# EAGLE design temp_board1 - itr2_V2 (EAGLE 9.6.2)
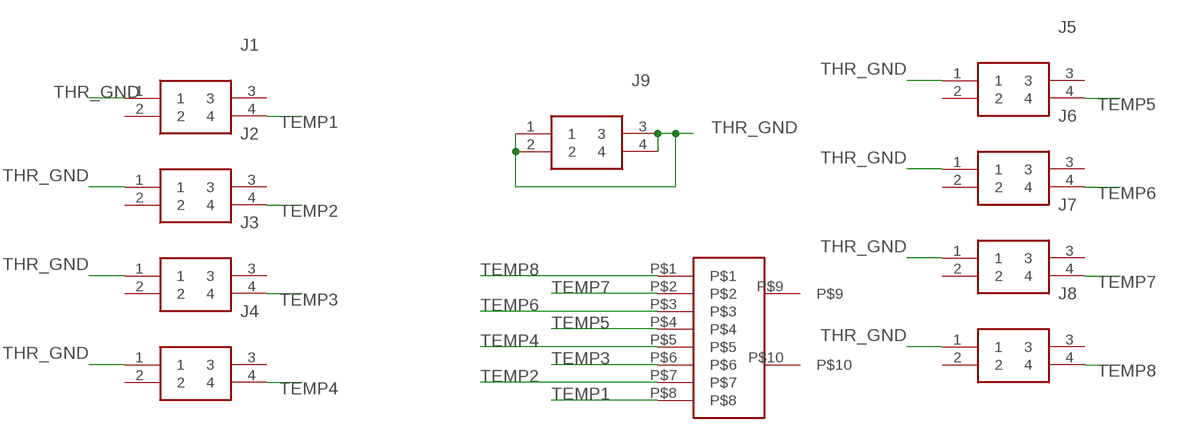
[diagram p0: schematic, sheet 1]

## Parts
J1  43045-0415  [43045-04YY_15,16,17]
J2  43045-0415  [43045-04YY_15,16,17]
J3  43045-0415  [43045-04YY_15,16,17]
J4  43045-0415  [43045-04YY_15,16,17]
J5  43045-0415  [43045-04YY_15,16,17]
J6  43045-0415  [43045-04YY_15,16,17]
J7  43045-0415  [43045-04YY_15,16,17]
J8  43045-0415  [43045-04YY_15,16,17]
J9  43045-0415  [43045-04YY_15,16,17]
U$35  VERTICALBMS8  [VERTICALBMS8]

## Nets
TEMP1: J1.4 U$35.P$8
TEMP2: J2.4 U$35.P$7
TEMP3: J3.4 U$35.P$6
TEMP4: J4.4 U$35.P$5
TEMP5: J5.4 U$35.P$4
TEMP6: J6.4 U$35.P$3
TEMP7: J7.4 U$35.P$2
TEMP8: J8.4 U$35.P$1
THR_GND: J1.1 J2.1 J3.1 J4.1 J5.1 J6.1 J7.1 J8.1 J9.1 J9.2 J9.3 J9.4
Unconnected: J1.2 J1.3 J2.2 J2.3 J3.2 J3.3 J4.2 J4.3 J5.2 J5.3 J6.2 J6.3 J7.2 J7.3 J8.2 J8.3 U$35.P$9 U$35.P$10

## Library data of the parts
J1-J9 = 43045-0415:43045-0415: Micro-Fit 3.0 Vertical Header, 3.00mm Pitch, Dual Row, 4 Circuits, with PCB Press-fit Metal Retention Clip, Glow-Wire Capable Source: Datasheet <https://www.molex.com/pdm_docs/sd/430450416_sd.pdf>; DESCRIPTION: Micro-Fit 3.0 Vertical Header, 3.00mm Pitch, Dual Row, 4 Circuits, with PCB Press-fit Metal Retention Clip, Glow-Wire Capable; HEIGHT: 9.91mm; MANUFACTURER_NAME: Molex; MANUFACTURER_PART_NUMBER: 43045-0415; MOUSER_PART_NUMBER: 538-43045-0415; MOUSER_PRICE-STOCK: https://www.mouser.co.uk/ProductDetail/Molex/43045-0415?qs=jbJnFeK%2FK6yEAHtN9jCMQg%3D%3D
U$35 = IIT_BOMBAY_Racing2:VERTICALBMS8

## Board
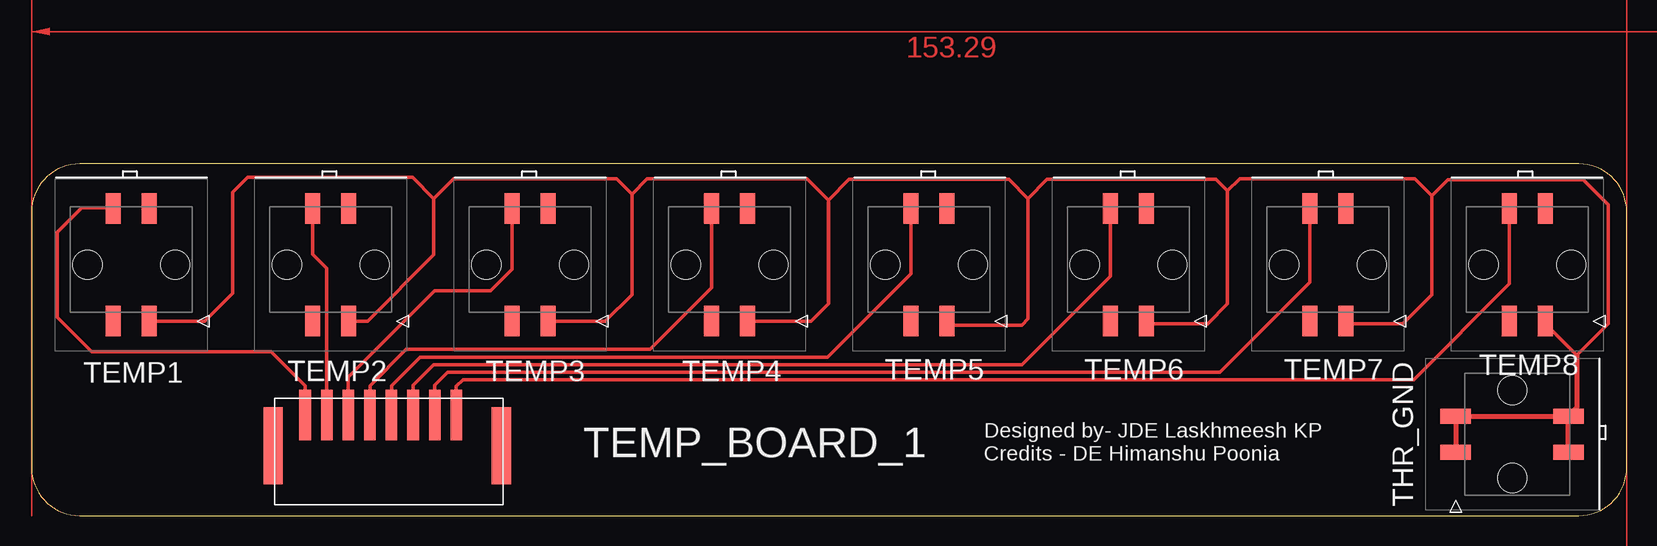
[diagram p1: board, top side]
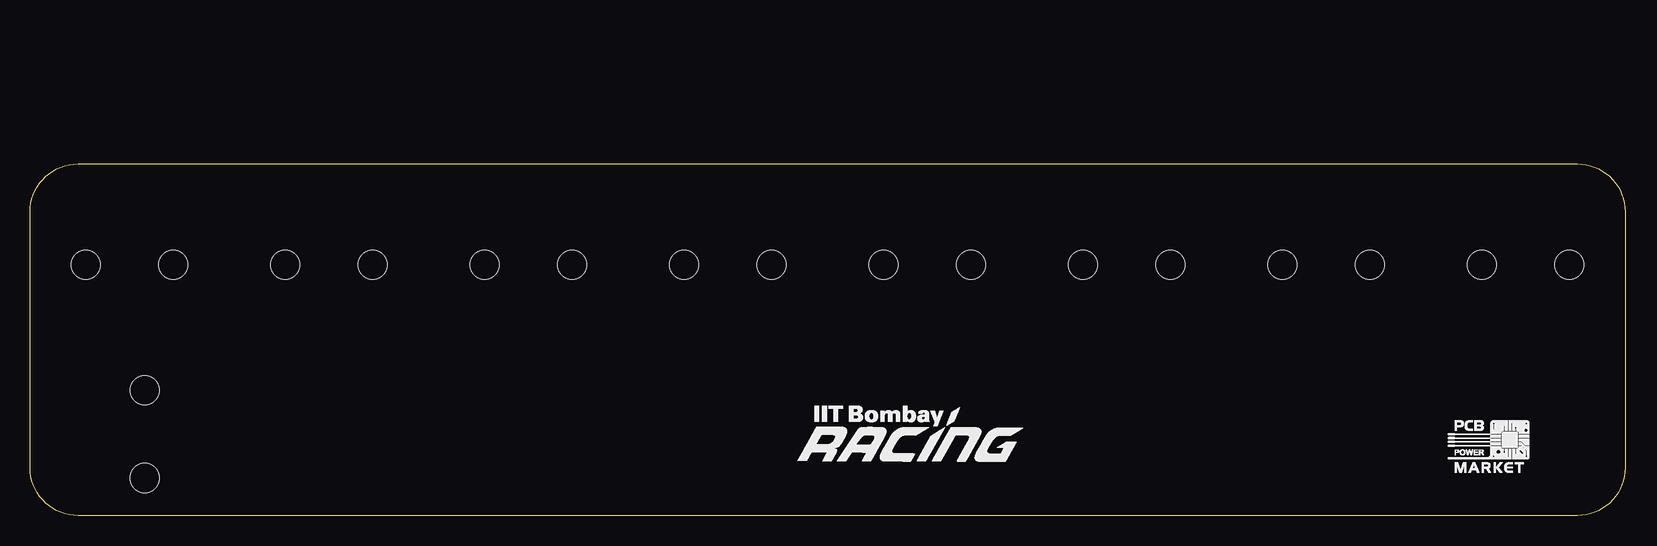
[diagram p2: board, bottom side, seen from below]

Size 132.97 x 29.31 mm. Coordinates in mm from the lower left corner, seen from the top.
Outline: 0,25.31 0,4 arc90 4,0 128.97,0 arc90 132.97,4 132.97,25.31 arc90 128.97,29.31 4,29.31 arc90 0,25.31
Copper layers (1*16): Top 0.035mm / dielectric 1.5mm / Bottom 0.035mm
Design rules "PCB_Power": minimum track width 5mil, minimum drill 10mil, track to track 5mil, track to pad 5mil, pad to pad 5mil, via to via 5mil, smd to smd 5mil, copper to edge 10mil, drill to drill 6mil, minimum pad ring 5mil, minimum via ring 5mil, stop-mask expansion 3mil, vias tented up to drill 0mil, thermal gap 10mil

### Footprints (pad centres in the part's own frame; a part is rotated, then mirrored left to right if it is on the bottom)
43045-04YY_15,16,17 = smd 1.27 x 2.54: 1 1.5,-4.7; 2 -1.5,-4.7; 3 1.5,4.7; 4 -1.5,4.7 | hole 2.41: 3.65,0; -3.65,0
VERTICALBMS8 = smd 0.97 x 4.2: P$1 -6.246,23; P$2 -4.446,23; P$3 -2.646,23; P$4 -0.846,23; P$5 0.954,23; P$6 2.754,23; P$7 4.554,23; P$8 6.354,23 | smd 1.6 x 6.4: P$9 -10,25.558; P$10 9.02,25.558

### Placement (x,y rotation side)
J1  8.31,20.9 0 top
J2  24.94,20.9 0 top
J3  41.56,20.9 0 top
J4  58.19,20.9 0 top
J5  74.81,20.9 0 top
J6  91.44,20.9 0 top
J7  108.06,20.9 0 top
J8  124.69,20.9 0 top
J9  123.42,6.78 270 top
U$8  LOGO_PCBPOWER  [270X170]  14.81,3.56 0 bottom
U$23  [IITBR_LOGO_180DIFF]  69.75,4.06 0 bottom
U$35  29.16,31.37 180 top

### Tracks (layer width: path | path; a pad name or v marks a point on that pad's centre or on a via)
TEMP1
  Top 0.305: U$35.P$8 22.8,10.83 19.99,13.65 5.02,13.65 2.16,16.51 2.16,23.62 4.19,25.65 6.76,25.65 J1.4
TEMP2
  Top 0.305: U$35.P$7 24.61,20.6 23.44,21.77 J2.4
TEMP3
  Top 0.305: U$35.P$6 26.41,11.55 33.6,18.74 38.28,18.74 40.06,20.52 J3.4
TEMP4
  Top 0.305: U$35.P$5 28.2,10.81 31.24,13.84 51.56,13.84 56.69,18.97 J4.4
TEMP5
  Top 0.305: U$35.P$4 30,10.83 32.38,13.21 66.37,13.21 73.31,20.15 J5.4
TEMP6
  Top 0.305: U$35.P$3 31.8,10.85 33.53,12.57 82.55,12.57 89.94,19.96 J6.4
TEMP7
  Top 0.305: U$35.P$2 33.6,10.87 34.67,11.94 99.06,11.94 106.56,19.44 J7.4
TEMP8
  Top 0.305: U$35.P$1 35.41,10.77 35.96,11.32 115.21,11.32 123.19,19.3 J8.4
THR_GND
  Top 0.305: 116.71,26.67 116.71,18.41 114.3,16 109.76,16 J7.1 | J6.1 93.14,16 98.04,16 99.69,17.65 99.69,27.05 | 83.06,26.42 83.06,16.38 82.55,15.88 76.64,15.88 J5.1 | 66.42,26.29 66.42,17.65 64.97,16.2 J4.1 | 33.53,26.42 33.53,21.72 28.01,16.2 J2.1 | J3.1 47.82,16.2 50.04,18.41 50.04,26.8 | J1.1 14.42,16.2 16.76,18.54 16.76,26.92 18.03,28.19 31.75,28.19 33.53,26.42 | 116.71,26.67 118.05,28 129.35,28 131.44,25.91 131.44,16 128.8,13.36 126.19,15.98 J8.1 | 116.71,26.67 115.32,28.07 100.71,28.07 99.69,27.05 | 99.69,27.05 98.73,28.02 84.66,28.02 83.06,26.42 | 83.06,26.42 81.46,28.02 68.15,28.02 66.42,26.29 | 66.42,26.29 64.64,28.07 51.31,28.07 50.04,26.8 | 50.04,26.8 48.77,28.07 35.18,28.07 33.53,26.42
  Top 0.406: 128.8,13.36 128.8,8.97 J9.4 | J9.3 J9.4 | J9.4 J9.2 J9.1
(copper drawn outside any net)
  shapes: Top area x2

### Text on the board
tNames: TEMP8 | TEMP1 | TEMP2 | TEMP3 | TEMP4 | TEMP5 | TEMP6 | TEMP7 | TEMP_BOARD_1 | Designed by- JDE Laskhmeesh KP / Credits - DE Himanshu Poonia | THR_GND